# Altium schematic sheet Filter.SchDoc
size 127 x 38 mm
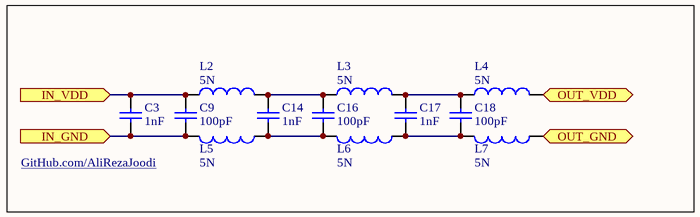
[diagram p0: Filter.SchDoc]

## Parts
C3  1nF  [CAPNTO2.54-3.56x2.03]
C9  100pF  [CAPNTO2.54-3.56x2.03]
C14  1nF  [CAPNTO2.54-3.56x2.03]
C16  100pF  [CAPNTO2.54-3.56x2.03]
C17  1nF  [CAPNTO2.54-3.56x2.03]
C18  100pF  [CAPNTO2.54-3.56x2.03]
L2  5N  [CAPPR5-6.3x11]
L3  5N  [CAPPR5-6.3x11]
L4  5N  [CAPPR5-6.3x11]
L5  5N  [CAPPR5-6.3x11]
L6  5N  [CAPPR5-6.3x11]
L7  5N  [CAPPR5-6.3x11]

## Ports
IN_GND (in), IN_VDD (in), OUT_GND (out), OUT_VDD (out)

## Nets
IN_GND: C3.1 C9.1 L5.2 ; port IN_GND
IN_VDD: C3.2 C9.2 L2.2 ; port IN_VDD
OUT_GND: L7.1 ; port OUT_GND
OUT_VDD: L4.1 ; port OUT_VDD
NetC14_1: C14.1 C16.1 L5.1 L6.2
NetC14_2: C14.2 C16.2 L2.1 L3.2
NetC17_1: C17.1 C18.1 L6.1 L7.2
NetC17_2: C17.2 C18.2 L3.1 L4.2

## Notes on the sheet
- GitHub.com/AliRezaJoodi

## Library data of the parts
C3 C9 C14 C16-C18 = Cap: Capacitor; Manufacturer: Generic Components; Class I: Passive; Published: 8-Jun-2000; Revision: July-2002: Re-released for DXP Platform.; Publisher: Altium Limited; Class II: Capacitor
L2-L7 = Inductor: Manufacturer: Generic Components; Class I: Passive; Published: 8-Jun-2000; Revision: July-2002: Re-released for DXP Platform.; Publisher: Altium Limited; Class II: Inductor; Supplier 1: Newark